# Altium project cwtrigger_usb.PrjPcb (part 1 of 2)
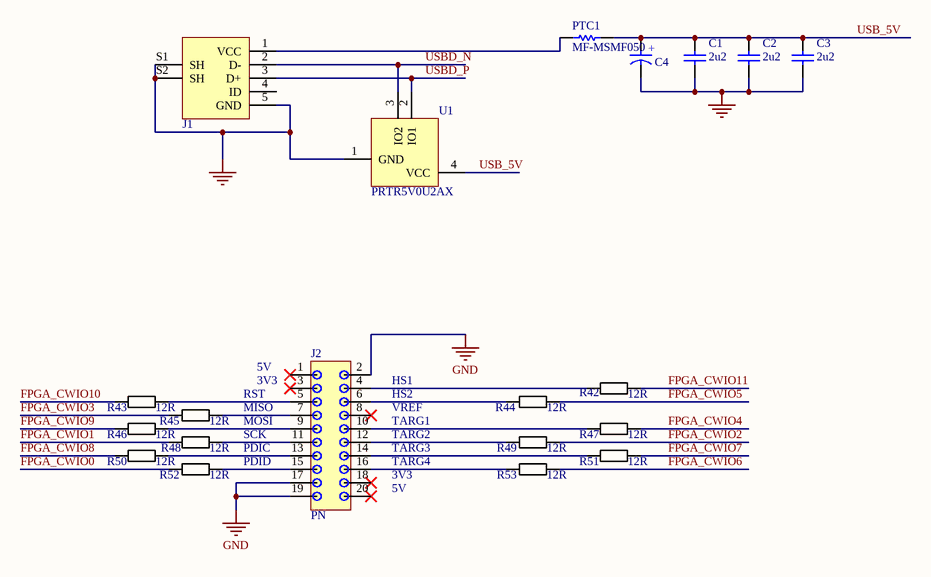
[diagram p0: ct_back.SchDoc]
PrjLicense: GPL; PrjName: PhyWhisperer-USB; PrjRev: 03
8 sheets, 163 parts. Net scope: global (net labels, ports and power ports of the same name join across sheets).
Board file: ct_mainpcb.PcbDoc
Sheets:
  ct_back.SchDoc
  ct_fpga_io.SchDoc
  ct_fpga_pwr.SchDoc
  ct_psu.SchDoc
  ct_micro.SchDoc
  fpga_misc.SchDoc
  ct_frontend.SchDoc
  ct_userio.SchDoc

## Sheet ct_back.SchDoc: Back Panel
size Letter; Organization: NewAE Technology Inc.; Address1: 1083 Queen St., Suite 196; Address2: Halifax; Address3: NS; Address4: Canada B3H 0B2; SheetNumber: 1; SheetTotal: 8; SheetApproved: YES

### Parts
C1  2u2  [CAPC0603_M]
C2  2u2  [CAPC0603_M]
C3  2u2  [CAPC0603_M]
C4  680uF  [Cap_16v_680uF]  (value not drawn)
J1  USB_MicroB_Jack  [ZX62D-B-5P8(30)]  (value not drawn)
J2  PN  [CON-20HDR-EDGEMOUNT]
PTC1  MF-MSMF050  [BOUR-MF-MSMF050-2_V]
R42  12R  [RESC1005X40N]
R43  12R  [RESC1005X40N]
R44  12R  [RESC1005X40N]
R45  12R  [RESC1005X40N]
R46  12R  [RESC1005X40N]
R47  12R  [RESC1005X40N]
R48  12R  [RESC1005X40N]
R49  12R  [RESC1005X40N]
R50  12R  [RESC1005X40N]
R51  12R  [RESC1005X40N]
R52  12R  [RESC1005X40N]
R53  12R  [RESC1005X40N]
U1  PRTR5V0U2AX  [SOT143B]

### Nets
GND: C1.2 C2.2 C3.2 C4.2 J1.5(GND) J1.S1(SH) J1.S2(SH) J2.2 J2.17 J2.19 U1.1(GND)
FPGA_CWIO0: R52.1
FPGA_CWIO1: R48.1
FPGA_CWIO2: R49.2
FPGA_CWIO3: R45.1
FPGA_CWIO4: R47.2
FPGA_CWIO5: R44.2
FPGA_CWIO6: R53.2
FPGA_CWIO7: R51.2
FPGA_CWIO8: R50.1
FPGA_CWIO9: R46.1
FPGA_CWIO10: R43.1
FPGA_CWIO11: R42.2
USB_5V: C1.1 C2.1 C3.1 C4.1 PTC1.2 U1.4(VCC)
USBD_N: J1.2(D-) U1.3(IO2)
USBD_P: J1.3(D+) U1.2(IO1)
NetJ1_1: J1.1(VCC) PTC1.1
NetJ2_4: J2.4 R42.1
NetJ2_5: J2.5 R43.2
NetJ2_6: J2.6 R44.1
NetJ2_7: J2.7 R45.2
NetJ2_9: J2.9 R46.2
NetJ2_10: J2.10 R47.1
NetJ2_11: J2.11 R48.2
NetJ2_12: J2.12 R49.1
NetJ2_13: J2.13 R50.2
NetJ2_14: J2.14 R51.1
NetJ2_15: J2.15 R52.2
NetJ2_16: J2.16 R53.1

Not connected (* = marked no-connect by the designer): J1 4(ID); J2 1* 3* 8* 18(10)* 20(10)*

### Notes on the sheet
- RST
- MISO
- MOSI
- 5V
- 3V3
- (near J2) TARG1
- (near J2) HS1
- (near J2) HS2
- (near J2) VREF
- SCK
- PDIC
- PDID
- (near J2) TARG4
- (near J2) TARG2
- (near J2) TARG3
- (near J2) 3V3
- (near J2) 5V
- Title:
- Date:
- Rev:
- Time:
- Project:
- Sheet
- of
- License:
- Copyright © NewAE Technology Inc.
- Approved:
- NewAE.com
- File:
- (in symbol Cap_16v_680uF) +

### Library data of the parts
C1-C3 = CCHIP-2u2-0603: 2u2, 0603; Manufacture 1: Samsung; Manufacture Part Number 1: CL10B225KP8NNNC; Component Group: Capacitor; Case-EIA: 0603; Case-Metric: 1608; Rated Voltage: 10VDC; Part Number: CCHIP-2u2-0603; Footprint: 0603; Pin Count: 2; Supplier 1: Digi-Key; Supplier Part Number 1: 1276-1134-2-ND; Value: 2u2; Mounting Technology: SMT; Component Kind: Standard; Component Type: Standard
C4 = Cap_16v_680uF: Aluminum electrolytic 680uF, 8x16mm, radial; Component Group: Capacitor; PP Material Stack: 0; Part Number: Cap_16v_680uF; Pin Count: 2; Value: 680uF; Mounting Technology: Through-hole; Component Kind: Standard; Component Type: Standard; PP Rotation: 0
J1 = ZX62D-B-5P8(30): CONN RCPT USB MICRO B SMD; Manufacture 1: Hirose Electric Co Ltd; Component Group: Connector; PP Material Stack: 0; Part Number: ZX62D-B-5P8(30); Manufacture Part Number 1: ZX62D-B-5P8(30); Pin Count: 5; Supplier 1: Digi-Key; Supplier Part Number 1: H125272CT-ND; Mounting Technology: Through-hole; RoHS: Yes; Component Kind: Standard; Component Type: Standard; PP Rotation: 0
J2 = CON20HDR-EDGE: Component Group: Connector; PP Material Stack: 0; Part Number: CON20HDR-EDGE; Pin Count: 20; Component Kind: Standard; Component Type: Standard; PP Rotation: 0; Supplier Part Number 1: S9172-ND; Supplier 1: Digi-Key
PTC1 = CMP-0280-00002-2: MF-MSMF Series - PTC Resettable Fuse, 15 V Max, 0.15 Ohm Min, -40 to 85 degC, RoHS, Reel; Manufacturer: Bourns; Voltage DC (Max): 15 V; Trip Current: 1 A; Hold Current: 0.5 A; Current Rating (Max): 100 A; ComponentLink1Description: Manufacturer URL; Operating Temperature Range: -40 to 85 degC; ComponentLink2URL: http://www.bourns.com/data/global/pdfs/mfmsmf.pdf; PackageReference: MF-MSMF050; ComponentLink2Description: Datasheet; PartNumber: MF-MSMF050; DatasheetVersion: Rev. AD; ComponentLink3URL: http://www.bourns.com/data/global/pdfs/mfmsmf.pdf; ComponentLink3Description: Package Specification; RoHS: TRUE; PackageDescription: 2-Pin SMD, Body 4.55 x 3.24 mm; Mounting Technology: Surface Mount; Packing: Reel; Resistance (Min): 0.15 Ohm; ComponentLink1URL: http://www.bourns.com/; Supplier 1: Digi-Key; Supplier Part Number 1: MF-MSMF050-2CT-ND
R42-R53 = RCHIP-12R-0402: 12R res, 0402, 1%, 1/16W; Manufacture 1: Yageo; Manufacture Part Number 1: RC0402FR-0712RL; Component Group: Resistor; Case-EIA: 0402; Case-Metric: 1005; Rated Power: 0.063W; Rated Voltage: 75VDC; Part Number: RCHIP-12R-0402; Footprint: 0402; Pin Count: 2; Supplier 1: Digi-Key; Supplier Part Number 1: YAG2968CT-ND; Value: 12R; Tolerance: 1%; Mounting Technology: SMT; Temperature Range: -55C to 155C; Component Kind: Standard; Component Type: Standard
U1 = PRTR5V0U2AX: USB 2.0 high-speed ESD; Component Group: Diode; Supplier 1: Digi-Key; Supplier Part Number 1: 568-7445-1-ND; Part Number: PRTR5V0U2AX; Pin Count: 4; Component Kind: Standard; Component Type: Standard

## Sheet ct_fpga_io.SchDoc: FPGA I/O
size Letter; Organization: NewAE Technology Inc.; Address1: 1083 Queen St., Suite 196; Address2: Halifax; Address3: NS; Address4: Canada B3H 0B2; SheetNumber: 2; SheetTotal: 8; SheetApproved: YES
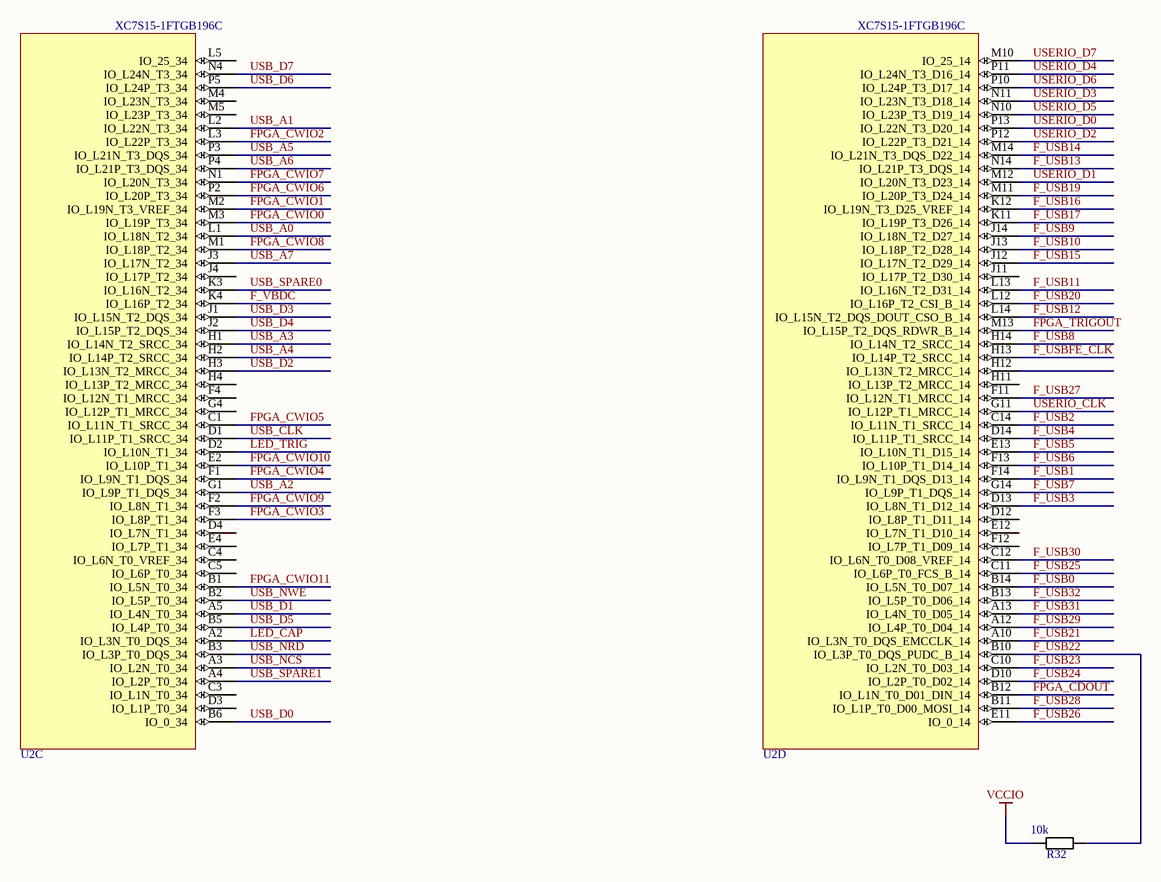
[diagram p1: ct_fpga_io.SchDoc]

### Parts
R32  10k  [RESC1608X55N]
U2  XC7S15-1FTGB196C  [BGA_FTGB196]  (parts C,D of 4)

### Nets
VCCIO: R32.1
F_USB0: U2.B14(IO_L5N_T0_D07_14)
F_USB1: U2.F14(IO_L9N_T1_DQS_D13_14)
F_USB2: U2.C14(IO_L11N_T1_SRCC_14)
F_USB3: U2.D13(IO_L8N_T1_D12_14)
F_USB4: U2.D14(IO_L11P_T1_SRCC_14)
F_USB5: U2.E13(IO_L10N_T1_D15_14)
F_USB6: U2.F13(IO_L10P_T1_D14_14)
F_USB7: U2.G14(IO_L9P_T1_DQS_14)
F_USB8: U2.H14(IO_L14N_T2_SRCC_14)
F_USB9: U2.J14(IO_L18N_T2_D27_14)
F_USB10: U2.J13(IO_L18P_T2_D28_14)
F_USB11: U2.L13(IO_L16N_T2_D31_14)
F_USB12: U2.L14(IO_L15N_T2_DQS_DOUT_CSO_B_14)
F_USB13: U2.N14(IO_L21P_T3_DQS_14)
F_USB14: U2.M14(IO_L21N_T3_DQS_D22_14)
F_USB15: U2.J12(IO_L17N_T2_D29_14)
F_USB16: U2.K12(IO_L19N_T3_D25_VREF_14)
F_USB17: U2.K11(IO_L19P_T3_D26_14)
F_USB19: U2.M11(IO_L20P_T3_D24_14)
F_USB20: U2.L12(IO_L16P_T2_CSI_B_14)
F_USB21: U2.A10(IO_L3N_T0_DQS_EMCCLK_14)
F_USB22: R32.2 U2.B10(IO_L3P_T0_DQS_PUDC_B_14)
F_USB23: U2.C10(IO_L2N_T0_D03_14)
F_USB24: U2.D10(IO_L2P_T0_D02_14)
F_USB25: U2.C11(IO_L6P_T0_FCS_B_14)
F_USB26: U2.E11(IO_0_14)
F_USB27: U2.F11(IO_L12N_T1_MRCC_14)
F_USB28: U2.B11(IO_L1P_T0_D00_MOSI_14)
F_USB29: U2.A12(IO_L4P_T0_D04_14)
F_USB30: U2.C12(IO_L6N_T0_D08_VREF_14)
F_USB31: U2.A13(IO_L4N_T0_D05_14)
F_USB32: U2.B13(IO_L5P_T0_D06_14)
F_USBFE_CLK: U2.H13(IO_L14P_T2_SRCC_14)
F_VBDC: U2.K4(IO_L16P_T2_34)
FPGA_CDOUT: U2.B12(IO_L1N_T0_D01_DIN_14)
FPGA_CWIO0: U2.M3(IO_L19P_T3_34)
FPGA_CWIO1: U2.M2(IO_L19N_T3_VREF_34)
FPGA_CWIO2: U2.L3(IO_L22P_T3_34)
FPGA_CWIO3: U2.F3(IO_L8P_T1_34)
FPGA_CWIO4: U2.F1(IO_L9N_T1_DQS_34)
FPGA_CWIO5: U2.C1(IO_L11N_T1_SRCC_34)
FPGA_CWIO6: U2.P2(IO_L20P_T3_34)
FPGA_CWIO7: U2.N1(IO_L20N_T3_34)
FPGA_CWIO8: U2.M1(IO_L18P_T2_34)
FPGA_CWIO9: U2.F2(IO_L8N_T1_34)
FPGA_CWIO10: U2.E2(IO_L10P_T1_34)
FPGA_CWIO11: U2.B1(IO_L5N_T0_34)
FPGA_TRIGOUT: U2.M13(IO_L15P_T2_DQS_RDWR_B_14)
LED_CAP: U2.A2(IO_L3N_T0_DQS_34)
LED_TRIG: U2.D2(IO_L10N_T1_34)
USB_A0: U2.L1(IO_L18N_T2_34)
USB_A1: U2.L2(IO_L22N_T3_34)
USB_A2: U2.G1(IO_L9P_T1_DQS_34)
USB_A3: U2.H1(IO_L14N_T2_SRCC_34)
USB_A4: U2.H2(IO_L14P_T2_SRCC_34)
USB_A5: U2.P3(IO_L21N_T3_DQS_34)
USB_A6: U2.P4(IO_L21P_T3_DQS_34)
USB_A7: U2.J3(IO_L17N_T2_34)
USB_CLK: U2.D1(IO_L11P_T1_SRCC_34)
USB_D0: U2.B6(IO_0_34)
USB_D1: U2.A5(IO_L4N_T0_34)
USB_D2: U2.H3(IO_L13N_T2_MRCC_34)
USB_D3: U2.J1(IO_L15N_T2_DQS_34)
USB_D4: U2.J2(IO_L15P_T2_DQS_34)
USB_D5: U2.B5(IO_L4P_T0_34)
USB_D6: U2.P5(IO_L24P_T3_34)
USB_D7: U2.N4(IO_L24N_T3_34)
USB_NCS: U2.A3(IO_L2N_T0_34)
USB_NRD: U2.B3(IO_L3P_T0_DQS_34)
USB_NWE: U2.B2(IO_L5P_T0_34)
USB_SPARE0: U2.K3(IO_L16N_T2_34)
USB_SPARE1: U2.A4(IO_L2P_T0_34)
USERIO_CLK: U2.G11(IO_L12P_T1_MRCC_14)
USERIO_D0: U2.P13(IO_L22N_T3_D20_14)
USERIO_D1: U2.M12(IO_L20N_T3_D23_14)
USERIO_D2: U2.P12(IO_L22P_T3_D21_14)
USERIO_D3: U2.N11(IO_L23N_T3_D18_14)
USERIO_D4: U2.P11(IO_L24N_T3_D16_14)
USERIO_D5: U2.N10(IO_L23P_T3_D19_14)
USERIO_D6: U2.P10(IO_L24P_T3_D17_14)
USERIO_D7: U2.M10(IO_25_14)

Not connected (* = marked no-connect by the designer): U2 C3(IO_L1N_T0_34) C4(IO_L6N_T0_VREF_34) C5(IO_L6P_T0_34) D3(IO_L1P_T0_34) D4(IO_L7N_T1_34) D12(IO_L8P_T1_D11_14) E4(IO_L7P_T1_34) E12(IO_L7N_T1_D10_14) F4(IO_L12N_T1_MRCC_34) F12(IO_L7P_T1_D09_14) G4(IO_L12P_T1_MRCC_34) H4(IO_L13P_T2_MRCC_34) H11(IO_L13P_T2_MRCC_14) H12(IO_L13N_T2_MRCC_14) J4(IO_L17P_T2_34) J11(IO_L17P_T2_D30_14) L5(IO_25_34) M4(IO_L23N_T3_34) M5(IO_L23P_T3_34)

### Notes on the sheet
- Title:
- Date:
- Rev:
- Time:
- Project:
- Sheet
- of
- License:
- Copyright © NewAE Technology Inc.
- Approved:
- NewAE.com
- File:

### Library data of the parts
R32 = RCHIP-10K-0603: 10k res, 0603, 1%, 1/10W; Manufacture 1: Yageo; Manufacture Part Number 1: RC0603FR-0710KL; Component Group: Resistor; Case-EIA: 0603; Case-Metric: 1608; Rated Power: 0.1W; Rated Voltage: 75VDC; Part Number: RCHIP-10K-0603; Footprint: 0603; Pin Count: 2; Supplier 1: Digi-Key; Supplier Part Number 1: 311-10.0KHRCT-ND; Value: 10k; Tolerance: 1%; Mounting Technology: SMT; Temperature Range: -55C to 155C; Component Kind: Standard; Component Type: Standard
U2 = XC7S15-1FTGB196C: Xilinx Spartan 7 FPGA, 196FTGB; Component Group: Digital IC; PP Material Stack: 0; Part Number: XC7S15-1FTGB196C; Manufacture 1: Xilinx; Manufacture Part Number 1: XC7S15-1FTGB196C; Pin Count: 196; Supplier 1: Digi-Key; Supplier Part Number 1: 122-2226-ND; Mounting Technology: SMT; Component Kind: Standard; Component Type: Standard; PP Rotation: 0

## Sheet ct_fpga_pwr.SchDoc: FPGA Power Connections
size Letter; SheetNumber: 3; SheetTotal: 8; SheetApproved: YES
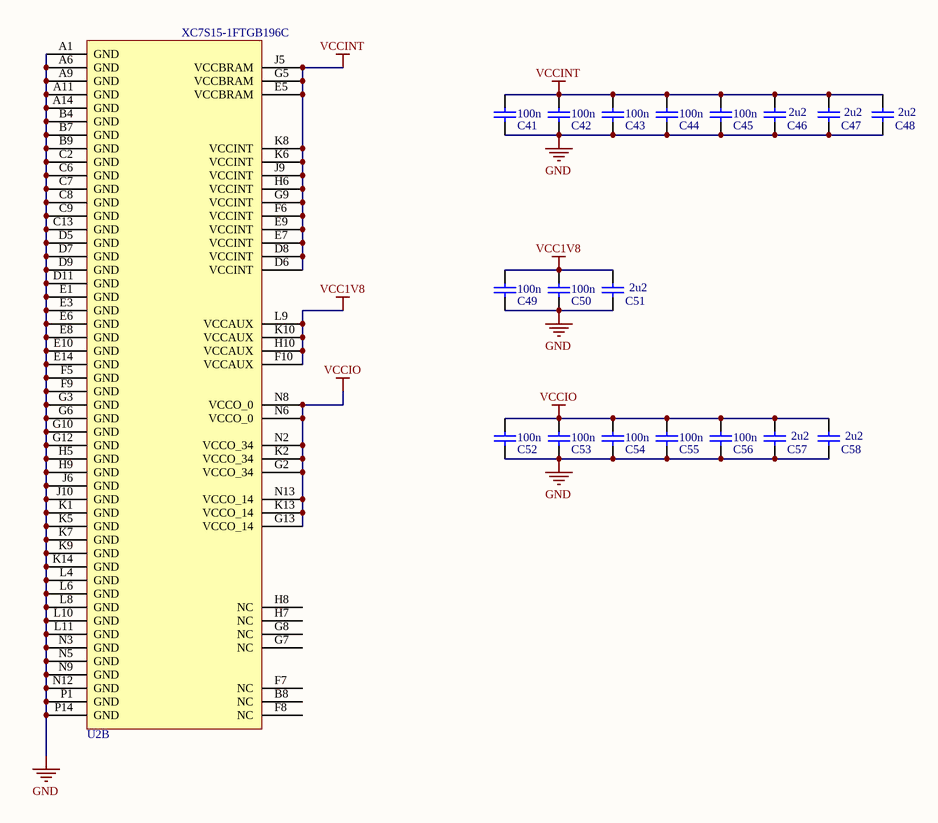
[diagram p2: ct_fpga_pwr.SchDoc]

### Parts
C41  100n  [CAPC0402_M]
C42  100n  [CAPC0402_M]
C43  100n  [CAPC0402_M]
C44  100n  [CAPC0402_M]
C45  100n  [CAPC0402_M]
C46  2u2  [CAPC0603_M]
C47  2u2  [CAPC0603_M]
C48  2u2  [CAPC0603_M]
C49  100n  [CAPC0402_M]
C50  100n  [CAPC0402_M]
C51  2u2  [CAPC0603_M]
C52  100n  [CAPC0402_M]
C53  100n  [CAPC0402_M]
C54  100n  [CAPC0402_M]
C55  100n  [CAPC0402_M]
C56  100n  [CAPC0402_M]
C57  2u2  [CAPC0603_M]
C58  2u2  [CAPC0603_M]
U2  XC7S15-1FTGB196C  [BGA_FTGB196]  (part B of 4)

### Nets
GND: C41.2 C42.2 C43.2 C44.2 C45.2 C46.2 C47.2 C48.2 C49.2 C50.2 C51.2 C52.2 C53.2 C54.2 C55.2 C56.2 C57.2 C58.2 U2.A1(GND) U2.A6(GND) U2.A9(GND) U2.A11(GND) U2.A14(GND) U2.B4(GND) U2.B7(GND) U2.B9(GND) U2.C2(GND) U2.C6(GND) U2.C7(GND) U2.C8(GND) U2.C9(GND) U2.C13(GND) U2.D5(GND) U2.D7(GND) U2.D9(GND) U2.D11(GND) U2.E1(GND) U2.E3(GND) U2.E6(GND) U2.E8(GND) U2.E10(GND) U2.E14(GND) U2.F5(GND) U2.F9(GND) U2.G3(GND) U2.G6(GND) U2.G10(GND) U2.G12(GND) U2.H5(GND) U2.H9(GND) U2.J6(GND) U2.J10(GND) U2.K1(GND) U2.K5(GND) U2.K7(GND) U2.K9(GND) U2.K14(GND) U2.L4(GND) U2.L6(GND) U2.L8(GND) U2.L10(GND) U2.L11(GND) U2.N3(GND) U2.N5(GND) U2.N9(GND) U2.N12(GND) U2.P1(GND) U2.P14(GND)
VCC1V8: C49.1 C50.1 C51.1 U2.F10(VCCAUX) U2.H10(VCCAUX) U2.K10(VCCAUX) U2.L9(VCCAUX)
VCCINT: C41.1 C42.1 C43.1 C44.1 C45.1 C46.1 C47.1 C48.1 U2.D6(VCCINT) U2.D8(VCCINT) U2.E5(VCCBRAM) U2.E7(VCCINT) U2.E9(VCCINT) U2.F6(VCCINT) U2.G5(VCCBRAM) U2.G9(VCCINT) U2.H6(VCCINT) U2.J5(VCCBRAM) U2.J9(VCCINT) U2.K6(VCCINT) U2.K8(VCCINT)
VCCIO: C52.1 C53.1 C54.1 C55.1 C56.1 C57.1 C58.1 U2.G2(VCCO_34) U2.G13(VCCO_14) U2.K2(VCCO_34) U2.K13(VCCO_14) U2.N2(VCCO_34) U2.N6(VCCO_0) U2.N8(VCCO_0) U2.N13(VCCO_14)

Not connected (* = marked no-connect by the designer): U2 B8(NC) F7(NC) F8(NC) G7(NC) G8(NC) H7(NC) H8(NC)

### Notes on the sheet
- Title:
- Date:
- Rev:
- Time:
- Project:
- Sheet
- of
- License:
- Copyright © NewAE Technology Inc.
- Approved:
- NewAE.com
- File:

### Library data of the parts
C41-C45 C49 C50 C52-C56 = CCHIP-100n-0402: 100n, 0402; Component Group: Capacitor; Case-EIA: 0402; Part Number: CCHIP-100n-0402; Footprint: 0402; Pin Count: 2; Value: 100n; Mounting Technology: SMT; Component Kind: Standard; Component Type: Standard
C46-C48 C51 C57 C58 = CCHIP-2u2-0603: as C1 on sheet ct_back; Part Number: CCHIP-2u2-0603; Footprint: 0603; Pin Count: 2; Supplier 1: Digi-Key; Supplier Part Number 1: 1276-1134-2-ND; Value: 2u2; Mounting Technology: SMT; Component Kind: Standard; Component Type: Standard
U2 = XC7S15-1FTGB196C: as U2 on sheet ct_fpga_io; Part Number: XC7S15-1FTGB196C; Manufacture 1: Xilinx; Manufacture Part Number 1: XC7S15-1FTGB196C; Pin Count: 196; Supplier 1: Digi-Key; Supplier Part Number 1: 122-2226-ND; Mounting Technology: SMT; Component Kind: Standard; Component Type: Standard; PP Rotation: 0

## Sheet ct_psu.SchDoc: Power Supply
size Letter; Organization: NewAE Technology Inc.; Address1: 1083 Queen St., Suite 196; Address2: Halifax; Address3: NS; Address4: Canada B3H 0B2; SheetNumber: 4; SheetTotal: 8; SheetApproved: YES
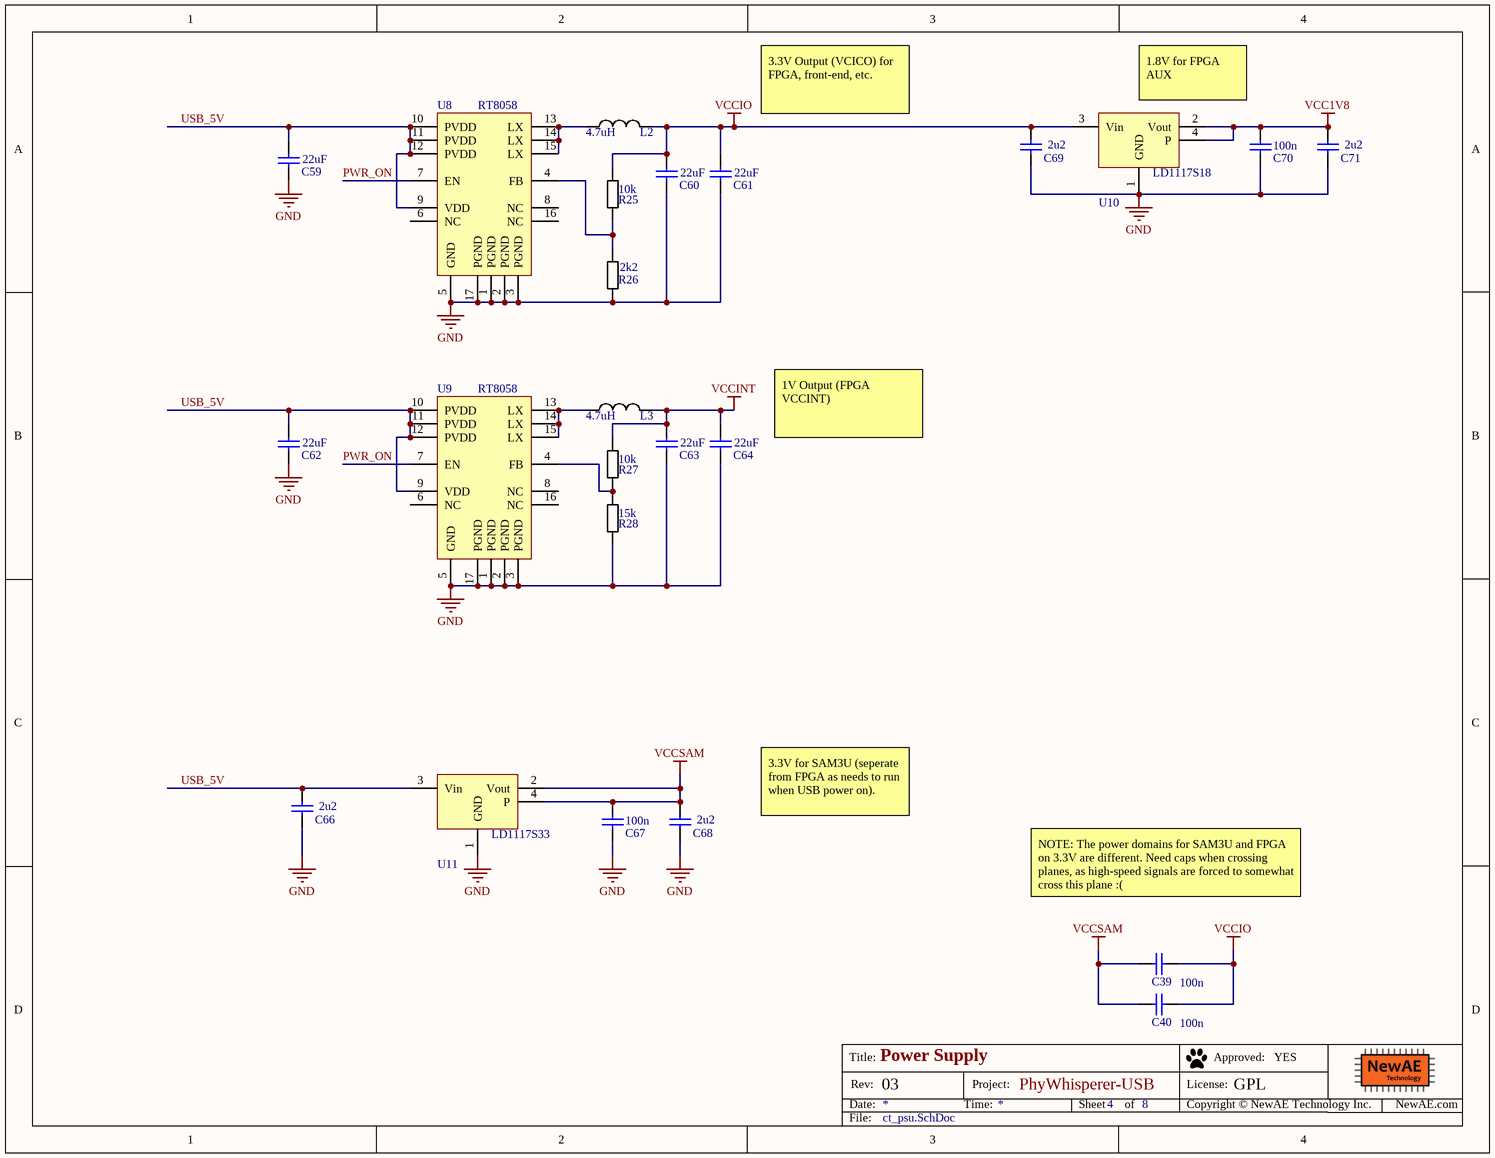
[diagram p3: ct_psu.SchDoc]

### Parts
C39  100n  [CAPC0603_M]
C40  100n  [CAPC0603_M]
C59  22uF  [CAPC0805_M]
C60  22uF  [CAPC0805_M]
C61  22uF  [CAPC0805_M]
C62  22uF  [CAPC0805_M]
C63  22uF  [CAPC0805_M]
C64  22uF  [CAPC0805_M]
C66  2u2  [CAPC0603_M]
C67  100n  [CAPC0402_M]
C68  2u2  [CAPC0603_M]
C69  2u2  [CAPC0603_M]
C70  100n  [CAPC0402_M]
C71  2u2  [CAPC0603_M]
L2  4.7uH  [NR6028]
L3  4.7uH  [NR6028]
R25  10k  [RESC1608X55N]
R26  2k2  [RESC1608X55N]
R27  10k  [RESC1608X55N]
R28  15k  [RESC1608X55N]
U8  RT8058  [QFN16_50P300X300X100_HS-17M]
U9  RT8058  [QFN16_50P300X300X100_HS-17M]
U10  LD1117S18  [SOT-223]
U11  LD1117S33  [SOT-223]

### Nets
GND: C59.2 C60.2 C61.2 C62.2 C63.2 C64.2 C66.2 C67.2 C68.2 C69.2 C70.2 C71.2 R26.2 R28.2 U8.1(PGND) U8.2(PGND) U8.3(PGND) U8.5(GND) U8.17(PGND) U9.1(PGND) U9.2(PGND) U9.3(PGND) U9.5(GND) U9.17(PGND) U10.1(GND) U11.1(GND)
VCC1V8: C70.1 C71.1 U10.2(Vout) U10.4(P)
VCCINT: C63.1 C64.1 L3.2 R27.1
VCCIO: C39.2 C40.2 C60.1 C61.1 C69.1 L2.2 R25.1 U10.3(Vin)
VCCSAM: C39.1 C40.1 C67.1 C68.1 U11.2(Vout) U11.4(P)
PWR_ON: U8.7(EN) U9.7(EN)
USB_5V: C59.1 C62.1 C66.1 U8.9(VDD) U8.10(PVDD) U8.11(PVDD) U8.12(PVDD) U9.9(VDD) U9.10(PVDD) U9.11(PVDD) U9.12(PVDD) U11.3(Vin)
NetL2_1: L2.1 U8.13(LX) U8.14(LX) U8.15(LX)
NetL3_1: L3.1 U9.13(LX) U9.14(LX) U9.15(LX)
NetR25_2: R25.2 R26.1 U8.4(FB)
NetR27_2: R27.2 R28.1 U9.4(FB)

Not connected (* = marked no-connect by the designer): U8 6(NC) 8(NC) 16(NC); U9 6(NC) 8(NC) 16(NC)

### Notes on the sheet
- 1.8V for FPGA AUX
- 3.3V Output (VCICO) for FPGA, front-end, etc.
- 1V Output (FPGA VCCINT)
- 3.3V for SAM3U (seperate from FPGA as needs to run when USB power on).
- NOTE: The power domains for SAM3U and FPGA on 3.3V are different. Need caps when crossing planes, as high-speed signals are forced to somewhat cross this plane :(
- Title:
- Date:
- Rev:
- Time:
- Project:
- Sheet
- of
- License:
- Copyright © NewAE Technology Inc.
- Approved:
- NewAE.com
- File:

### Library data of the parts
C39 C40 = CCHIP-100n-0603: 100n, 0603; Manufacture 1: Kemet; Manufacture Part Number 1: C0603C104K5RACTU; Component Group: Capacitor; Case-EIA: 0603; Case-Metric: 1608; Rated Voltage: 50VDC; Part Number: CCHIP-100n-0603; Footprint: 0603; Pin Count: 2; Supplier 1: Digi-Key; Supplier Part Number 1: 399-5089-2-ND; Value: 100n; Mounting Technology: SMT; Component Kind: Standard; Component Type: Standard
C59-C64 = CCHIP-22u-0805-16V: 22u, 16V, 0805, Ceramic; Manufacture 1: Samsung Electro-Mechanics; Manufacture Part Number 1: CL21A226MOCLRNC; Component Group: Capacitor; Case-EIA: 0805; Case-Metric: 1608; Rated Voltage: 16VDC; Tolerance: 20%; Part Number: CCHIP-22u-0805-16V; Footprint: 0805; Pin Count: 2; Supplier 1: Digi-Key; Supplier Part Number 1: 1276-6780-1-ND; Value: 22uF; Mounting Technology: SMT; RoHS: Yes; Component Kind: Standard; Component Type: Standard
C66 C68 C69 C71 = CCHIP-2u2-0603: as C1 on sheet ct_back; Part Number: CCHIP-2u2-0603; Footprint: 0603; Pin Count: 2; Supplier 1: Digi-Key; Supplier Part Number 1: 1276-1134-2-ND; Value: 2u2; Mounting Technology: SMT; Component Kind: Standard; Component Type: Standard
C67 C70 = CCHIP-100n-0402: as C41 on sheet ct_fpga_pwr; Part Number: CCHIP-100n-0402; Footprint: 0402; Pin Count: 2; Value: 100n; Mounting Technology: SMT; Component Kind: Standard; Component Type: Standard
L2 L3 = NR6028T4R7M: fixed ind, ferrite, shielded; Manufacture 1: Taiyo Yuden; Component Group: Inductor; Case-Metric: 6060; Part Number: NR6028T4R7M; Footprint: SMD,6x6mm; Manufacture Part Number 1: NR6028T4R7M; Pin Count: 2; Supplier 1: Digi-Key; Supplier Part Number 1: 587-2100-1-ND; Value: 4.7uH; Mounting Technology: SMT; Component Kind: Standard; Component Type: Standard
R25 R27 = RCHIP-10K-0603: as R32 on sheet ct_fpga_io; Part Number: RCHIP-10K-0603; Footprint: 0603; Pin Count: 2; Supplier 1: Digi-Key; Supplier Part Number 1: 311-10.0KHRCT-ND; Value: 10k; Tolerance: 1%; Mounting Technology: SMT; Temperature Range: -55C to 155C; Component Kind: Standard; Component Type: Standard
R26 = RCHIP-2K2-0603: 2k2 res, 0603, 1%, 1/10W; Manufacture 1: Yageo; Manufacture Part Number 1: RC0603FR-072K2L; Component Group: Resistor; Case-EIA: 0603; Case-Metric: 1608; Rated Power: 0.1W; Rated Voltage: 75VDC; Part Number: RCHIP-2K2-0603; Footprint: 0603; Pin Count: 2; Supplier 1: Digi-Key; Supplier Part Number 1: 311-2.20KHRCT-ND; Value: 2k2; Tolerance: 1%; Mounting Technology: SMT; Temperature Range: -55C to 155C; Component Kind: Standard; Component Type: Standard
R28 = RCHIP-15K-0603: 15k res, 0603, 1%, 1/10W; Manufacture 1: Yageo; Manufacture Part Number 1: RC0603FR-0715KL; Component Group: Resistor; Case-EIA: 0603; Case-Metric: 1608; Rated Power: 0.1W; Rated Voltage: 75VDC; Part Number: RCHIP-15K-0603; Footprint: 0603; Pin Count: 2; Supplier 1: Digi-Key; Supplier Part Number 1: 311-15.0KHRCT-ND; Value: 15k; Tolerance: 1%; Mounting Technology: SMT; Temperature Range: -55C to 155C; Component Kind: Standard; Component Type: Standard
U8 U9 = RT8058: Switching supply controller, 2A; Manufacture 1: Richtek; Component Group: Analog IC; PP Material Stack: 0; Part Number: RT8058; Footprint: QFN16; Manufacture Part Number 1: RT8058; Pin Count: 17; Component Kind: Standard; Component Type: Standard; PP Rotation: 0
U10 = LD1117S18: IC REG LIN POS 1.8V 800MA SOT223; Manufacture 1: STMicroelectronics; Manufacture Part Number 1: LD1117S18TR; Component Group: Analog IC; Rated Voltage: 15V; PP Material Stack: 0; Part Number: LD1117S18; Pin Count: 3; Supplier 1: Digi-Key; Supplier Part Number 1: 497-7308-1-ND; Mounting Technology: SMT; RoHS: Yes; Component Kind: Standard; Component Type: Standard; PP Rotation: 0
U11 = LD1117S33: IC REG LIN POS 3.3V 800MA SOT223; Manufacture 1: STMicroelectronics; Manufacture Part Number 1: LD1117S33TR; Component Group: Analog IC; Rated Voltage: 15V; PP Material Stack: 0; Part Number: LD1117S33; Pin Count: 3; Supplier 1: Digi-Key; Supplier Part Number 1: 497-1242-1-ND; Mounting Technology: SMT; RoHS: Yes; Component Kind: Standard; Component Type: Standard; PP Rotation: 0

## Sheet ct_micro.SchDoc: Microcontroller
size Letter; Organization: NewAE Technology Inc.; Address1: 1083 Queen St., Suite 196; Address2: Halifax; Address3: NS; Address4: Canada B3H 0B2; SheetNumber: 5; SheetTotal: 8; SheetApproved: YES
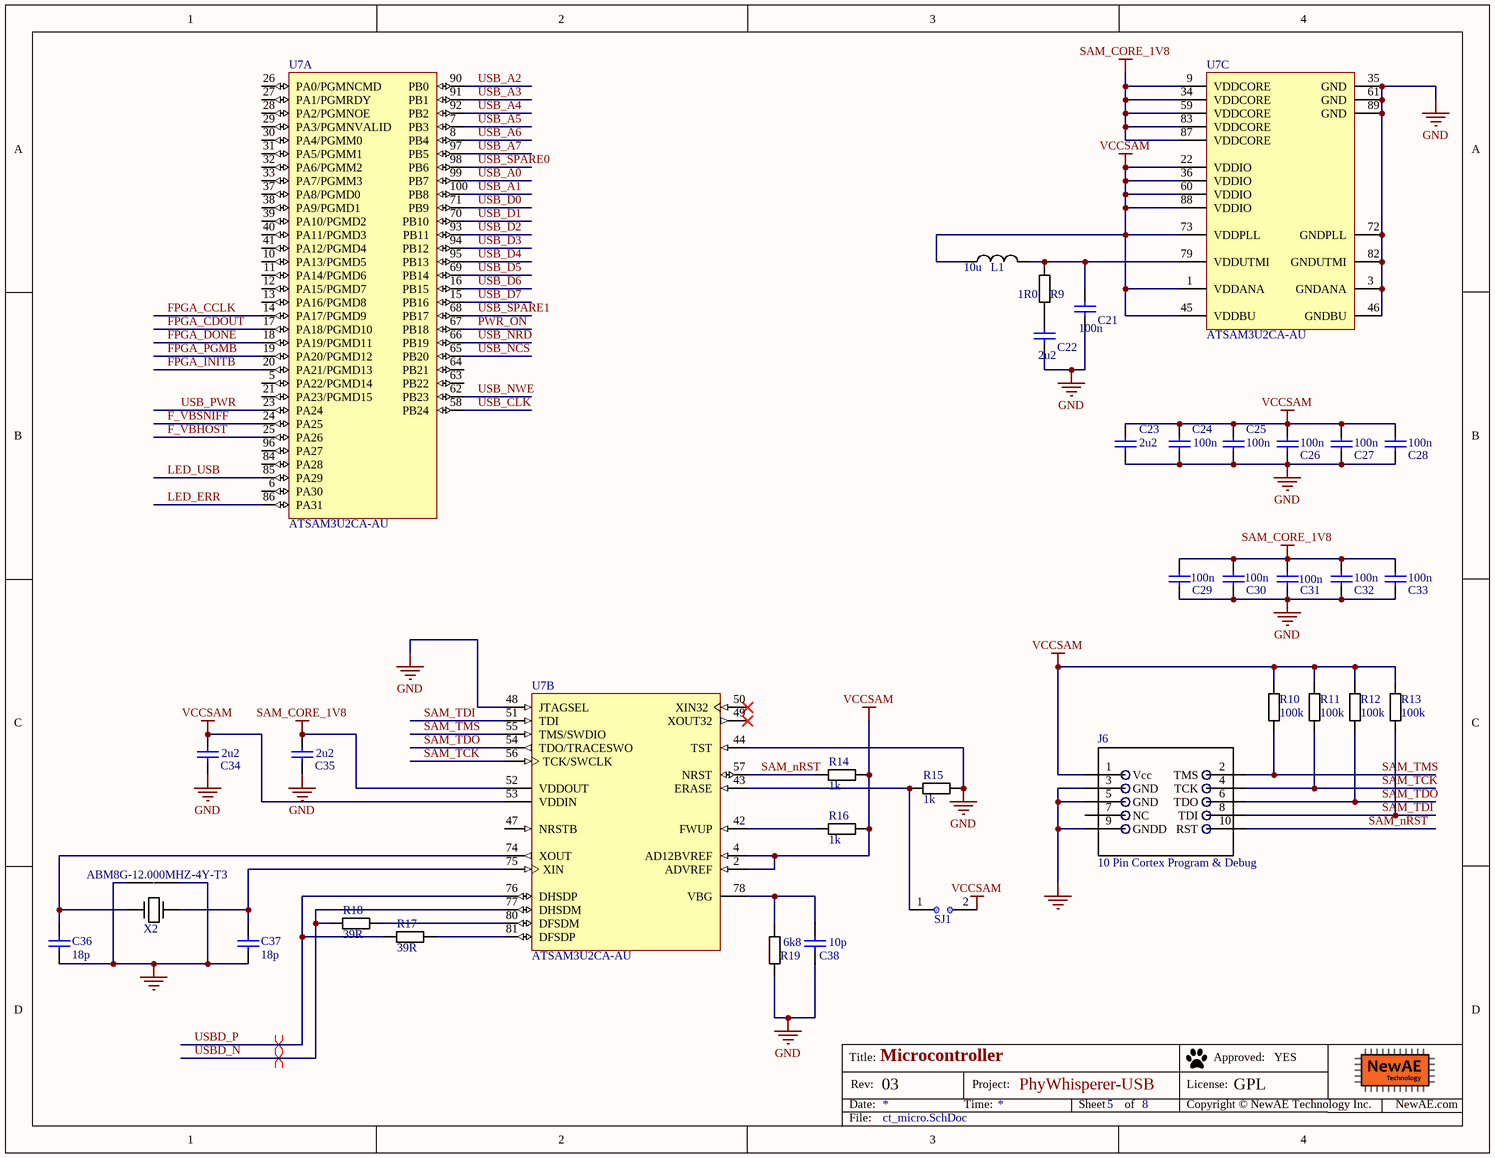
[diagram p4: ct_micro.SchDoc]

### Parts
C21  100n  [CAPC0402_M]
C22  2u2  [CAPC0603_M]
C23  2u2  [CAPC0603_M]
C24  100n  [CAPC0402_M]
C25  100n  [CAPC0402_M]
C26  100n  [CAPC0402_M]
C27  100n  [CAPC0402_M]
C28  100n  [CAPC0402_M]
C29  100n  [CAPC0402_M]
C30  100n  [CAPC0402_M]
C31  100n  [CAPC0402_M]
C32  100n  [CAPC0402_M]
C33  100n  [CAPC0402_M]
C34  2u2  [CAPC0603_M]
C35  2u2  [CAPC0603_M]
C36  18p  [CAPC0402_M]
C37  18p  [CAPC0402_M]
C38  10p  [CAPC0603_M]
J6  10 Pin Cortex Program & Debug  [0.5mm_SMD_Header_5x2]
L1  10u  [IND_0603]
R9  1R0  [RESC1608X55N]
R10  100k  [RESC1608X55N]
R11  100k  [RESC1608X55N]
R12  100k  [RESC1608X55N]
R13  100k  [RESC1608X55N]
R14  1k  [RESC1608X55N]
R15  1k  [RESC1608X55N]
R16  1k  [RESC1608X55N]
R17  39R  [RESC1608X55N]
R18  39R  [RESC1608X55N]
R19  6k8  [RESC1608X55N]
SJ1  NO  [SJ_2S_NO]  (value not drawn)  (no BOM)
U7  ATSAM3U2CA-AU  [LQFP100_L]  (parts A,B,C of 3)
X2  ABM8G-12.000MHZ-4Y-T3  [ABM8G]

### Nets
GND: C21.2 C22.2 C23.2 C24.2 C25.2 C26.2 C27.2 C28.2 C29.2 C30.2 C31.2 C32.2 C33.2 C34.2 C35.2 C36.2 C37.2 C38.2 J6.3(GND) J6.5(GND) J6.9(GNDD) R15.2 R19.2 U7.3(GNDANA) U7.35(GND) U7.44(TST) U7.46(GNDBU) U7.48(JTAGSEL) U7.61(GND) U7.72(GNDPLL) U7.82(GNDUTMI) U7.89(GND) X2.2(GND) X2.4(GND)
SAM_CORE_1V8: C29.1 C30.1 C31.1 C32.1 C33.1 C35.1 U7.9(VDDCORE) U7.34(VDDCORE) U7.52(VDDOUT) U7.59(VDDCORE) U7.83(VDDCORE) U7.87(VDDCORE)
VCCSAM: C23.1 C24.1 C25.1 C26.1 C27.1 C28.1 C34.1 J6.1(Vcc) L1.1 R10.1 R11.1 R12.1 R13.1 R14.2 R16.2 SJ1.2 U7.1(VDDANA) U7.2(ADVREF) U7.4(AD12BVREF) U7.22(VDDIO) U7.36(VDDIO) U7.45(VDDBU) U7.53(VDDIN) U7.60(VDDIO) U7.73(VDDPLL) U7.88(VDDIO)
F_VBHOST: U7.25(PA26)
F_VBSNIFF: U7.24(PA25)
FPGA_CCLK: U7.14(PA17/PGMD9)
FPGA_CDOUT: U7.17(PA18/PGMD10)
FPGA_DONE: U7.18(PA19/PGMD11)
FPGA_INITB: U7.20(PA21/PGMD13)
FPGA_PGMB: U7.19(PA20/PGMD12)
LED_ERR: U7.86(PA31)
LED_USB: U7.85(PA29)
PWR_ON: U7.67(PB18)
SAM_nRST: J6.10(RST) R14.1 U7.57(NRST)
SAM_TCK: J6.4(TCK) R11.2 U7.56(TCK/SWCLK)
SAM_TDI: J6.8(TDI) R13.2 U7.51(TDI)
SAM_TDO: J6.6(TDO) R12.2 U7.54(TDO/TRACESWO)
SAM_TMS: J6.2(TMS) R10.2 U7.55(TMS/SWDIO)
USB_A0: U7.99(PB7)
USB_A1: U7.100(PB8)
USB_A2: U7.90(PB0)
USB_A3: U7.91(PB1)
USB_A4: U7.92(PB2)
USB_A5: U7.7(PB3)
USB_A6: U7.8(PB4)
USB_A7: U7.97(PB5)
USB_CLK: U7.58(PB24)
USB_D0: U7.71(PB9)
USB_D1: U7.70(PB10)
USB_D2: U7.93(PB11)
USB_D3: U7.94(PB12)
USB_D4: U7.95(PB13)
USB_D5: U7.69(PB14)
USB_D6: U7.16(PB15)
USB_D7: U7.15(PB16)
USB_NCS: U7.65(PB20)
USB_NRD: U7.66(PB19)
USB_NWE: U7.62(PB23)
USB_PWR: U7.23(PA24)
USB_SPARE0: U7.98(PB6)
USB_SPARE1: U7.68(PB17)
USBD_N: R18.1 U7.77(DHSDM)
USBD_P: R17.1 U7.76(DHSDP)
NetC21_1: C21.1 L1.2 R9.1 U7.79(VDDUTMI)
NetC22_1: C22.1 R9.2
NetC36_1: C36.1 U7.74(XOUT) X2.1(IN)
NetC37_1: C37.1 U7.75(XIN) X2.3(OUT)
NetC38_1: C38.1 R19.1 U7.78(VBG)
NetR15_1: R15.1 SJ1.1 U7.43(ERASE)
NetR16_1: R16.1 U7.42(FWUP)
NetR17_2: R17.2 U7.81(DFSDP)
NetR18_2: R18.2 U7.80(DFSDM)

Not connected (* = marked no-connect by the designer): J6 7(NC); U7 5(PA22/PGMD14) 6(PA30) 10(PA13/PGMD5) 11(PA14/PGMD6) 12(PA15/PGMD7) 13(PA16/PGMD8) 21(PA23/PGMD15) 26(PA0/PGMNCMD) 27(PA1/PGMRDY) 28(PA2/PGMNOE) 29(PA3/PGMNVALID) 30(PA4/PGMM0) 31(PA5/PGMM1) 32(PA6/PGMM2) 33(PA7/PGMM3) 37(PA8/PGMD0) 38(PA9/PGMD1) 39(PA10/PGMD2) 40(PA11/PGMD3) 41(PA12/PGMD4) 47(NRSTB) 49(XOUT32)* 50(XIN32)* 63(PB22) 64(PB21) 84(PA28) 96(PA27)

### Layout directives
differential pair: USBD_N, USBD_P

### Notes on the sheet
- Title:
- Date:
- Rev:
- Time:
- Project:
- Sheet
- of
- License:
- Copyright © NewAE Technology Inc.
- Approved:
- NewAE.com
- File:

### Library data of the parts
C21 C24-C33 = CCHIP-100n-0402: as C41 on sheet ct_fpga_pwr; Part Number: CCHIP-100n-0402; Footprint: 0402; Pin Count: 2; Value: 100n; Mounting Technology: SMT; Component Kind: Standard; Component Type: Standard
C22 C23 C34 C35 = CCHIP-2u2-0603: as C1 on sheet ct_back; Part Number: CCHIP-2u2-0603; Footprint: 0603; Pin Count: 2; Supplier 1: Digi-Key; Supplier Part Number 1: 1276-1134-2-ND; Value: 2u2; Mounting Technology: SMT; Component Kind: Standard; Component Type: Standard
C36 C37 = CCHIP-18p-0402: 18p, 0402; Manufacture Part Number 1: GRM1555C1H180JA01D; Component Group: Capacitor; Case-EIA: 0402; Part Number: CCHIP-18p-0402; Footprint: 0402; Pin Count: 2; Value: 18p; Mounting Technology: SMT; Component Kind: Standard; Component Type: Standard
C38 = CCHIP-10p-0603: 10p, 0603; Component Group: Capacitor; Case-EIA: 0603; Case-Metric: 1608; Part Number: CCHIP-10p-0603; Footprint: 0603; Pin Count: 2; Supplier 1: Digi-Key; Supplier Part Number 1: 399-1049-1-ND; Value: 10p; Mounting Technology: SMT; Component Kind: Standard; Component Type: Standard
J6 = Cortex_Debug_Header_10Pin: 10 Pin Cortex Program & Debug 0.5mm pitch; Manufacture Part Number 1: 20021121-00010C4LF; Component Group: Connector; PP Material Stack: 0; Part Number: Cortex_Debug_Header_10Pin; Pin Count: 10; Supplier 1: Digi-Key; Supplier Part Number 1: 609-3695-1-ND; Mounting Technology: SMT; RoHS: Yes; Component Kind: Standard; Component Type: Standard; PP Rotation: 0
L1 = LCHIP-10U-0603: FIXED IND 10UH 50MA 900 MOHM SMD; Manufacture 1: Murata Electronics North America; Manufacture Part Number 1: LQM18FN100M00D; Component Group: Inductor; Case-EIA: 0603; Case-Metric: 1608; Tolerance: ±20%; PP Material Stack: 0; Part Number: LCHIP-10U-0603; Footprint: 0603; Pin Count: 2; Supplier 1: Digi-Key; Supplier Part Number 1: 490-4025-1-ND; Value: 10u; Mounting Technology: SMT; Component Kind: Standard; Component Type: Standard; PP Rotation: 0
R9 = RCHIP-1R0-0603: 1R0 res, 0603, 1%, 1/10W; Manufacture 1: Yageo; Manufacture Part Number 1: RC0603FR-071RL; Component Group: Resistor; Case-EIA: 0603; Case-Metric: 1608; Rated Power: 0.1W; Rated Voltage: 75VDC; Part Number: RCHIP-1R0-0603; Footprint: 0603; Pin Count: 2; Supplier 1: Digi-Key; Supplier Part Number 1: 311-1.00HRCT-ND; Value: 1R0; Tolerance: 1%; Mounting Technology: SMT; Temperature Range: -55C to 155C; Component Kind: Standard; Component Type: Standard
R10-R13 = RCHIP-100K-0603: 100k res, 0603, 1%, 1/10W; Manufacture 1: Yageo; Manufacture Part Number 1: RC0603FR-07100KL; Component Group: Resistor; Case-EIA: 0603; Case-Metric: 1608; Rated Power: 0.1W; Rated Voltage: 75VDC; Part Number: RCHIP-100K-0603; Footprint: 0603; Pin Count: 2; Supplier 1: Digi-Key; Supplier Part Number 1: 311-100KHRCT-ND; Value: 100k; Tolerance: 1%; Mounting Technology: SMT; Temperature Range: -55C to 155C; Component Kind: Standard; Component Type: Standard
R14-R16 = RCHIP-1K-0603: 1k res, 0603, 1%, 1/10W; Manufacture 1: Yageo; Manufacture Part Number 1: RC0603FR-071KL; Component Group: Resistor; Case-EIA: 0603; Case-Metric: 1608; Rated Power: 0.1W; Rated Voltage: 75VDC; Part Number: RCHIP-1K-0603; Footprint: 0603; Pin Count: 2; Supplier 1: Digi-Key; Supplier Part Number 1: 311-1.00KHRCT-ND; Value: 1k; Tolerance: 1%; Mounting Technology: SMT; Temperature Range: -55C to 155C; Component Kind: Standard; Component Type: Standard
R17 R18 = RCHIP-39R-0603: 39R res, 0603, 1%, 1/10W; Manufacture 1: Yageo; Manufacture Part Number 1: RC0603FR-0739RL; Component Group: Resistor; Case-EIA: 0603; Case-Metric: 1608; Rated Power: 0.1W; Rated Voltage: 75VDC; Part Number: RCHIP-39R-0603; Footprint: 0603; Pin Count: 2; Supplier 1: Digi-Key; Supplier Part Number 1: 311-39.0HRCT-ND; Value: 39R; Tolerance: 1%; Mounting Technology: SMT; Temperature Range: -55C to 155C; Component Kind: Standard; Component Type: Standard
R19 = RCHIP-6K8-0603: 6k8 res, 0603, 1%, 1/10W; Manufacture 1: Yageo; Manufacture Part Number 1: RC0603FR-076K8L; Component Group: Resistor; Case-EIA: 0603; Case-Metric: 1608; Rated Power: 0.1W; Rated Voltage: 75VDC; Part Number: RCHIP-6K8-0603; Footprint: 0603; Pin Count: 2; Supplier 1: Digi-Key; Supplier Part Number 1: 311-6.80KHRCT-ND; Value: 6k8; Tolerance: 1%; Mounting Technology: SMT; Temperature Range: -55C to 155C; Component Kind: Standard; Component Type: Standard
SJ1 = SJ_2S_NO: Solder Jumper, NO; Component Group: PCB Feature; Part Number: SJ_2S_NO; Pin Count: 2; Mounting Technology: COPPER; Component Type: Standard (No BOM)
U7 = CMP-0076-00087-2: AT91 ARM Cortex-M3 32-bit Microcontroller, 128KB Flash, 36KB SRAM, 57 User I/Os, 3USARTs, 100-Pin LQFP, Industrial Grade (-40°C to 85°C), Pb-Free; ComponentLink3URL: http://www.atmel.com/dyn/resources/prod_documents/6430s.pdf; PackageReference: LQFP100; ComponentLink2Description: SAM3U Series Datasheet; Code_JEDEC: MS-026-BED; ComponentLink1Description: Manufacturer URL; PackageVersion: Apr-2006; PackageDescription: 100-Pin Thin Quad Flat Pack 0.5 mm Pitch; DatasheetVersion: revC, Apr-2010; RevisionNote: DatasheetVersion updated. URLs added.; ComponentLink3Description: SAM3U Series Summary; ComponentLink2URL: http://www.atmel.com/dyn/resources/prod_documents/doc6430.pdf; ComponentLink1URL: http://www.atmel.com/; PartId: 1
X2 = ABM8G-12.000MHZ-4Y-T3: CRYSTAL 12.0000MHZ 10PF SMD; Manufacture 1: Abracon LLC; Part Number: ABM8G-12.000MHZ-4Y-T3; Component Group: Crystal; Manufacture Part Number 1: ABM8G-12.000MHZ-4Y-T3; Pin Count: 4; Supplier 1: Digi-Key; Supplier Part Number 1: 535-10901-1-ND; Component Kind: Standard; Component Type: Standard; Value: 12.000MHz

## Sheet fpga_misc.SchDoc: FPGA Misc
size Letter; SheetNumber: 6; SheetTotal: 8; SheetApproved: YES
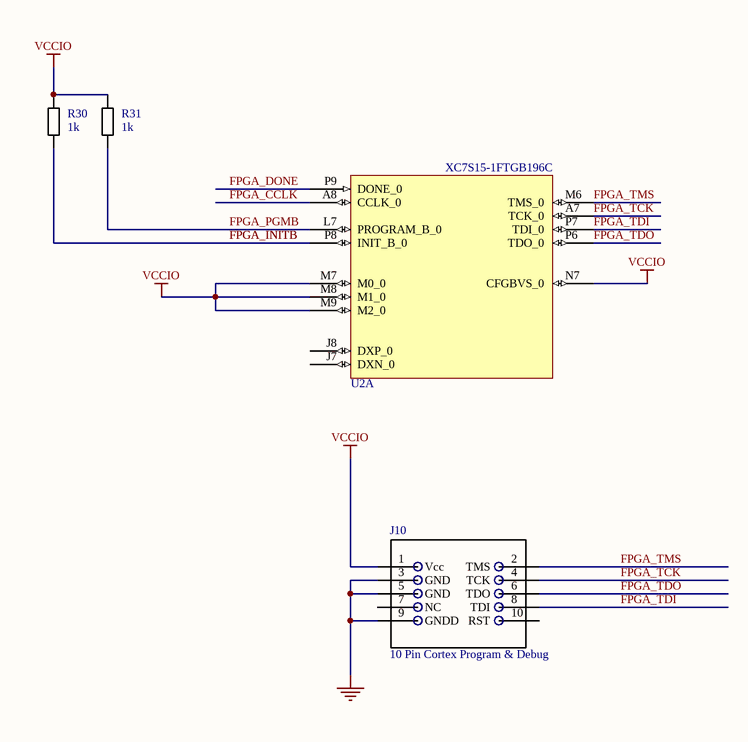
[diagram p5: fpga_misc.SchDoc]

### Parts
J10  10 Pin Cortex Program & Debug  [0.5mm_SMD_Header_5x2]
R30  1k  [RESC1608X55N]
R31  1k  [RESC1608X55N]
U2  XC7S15-1FTGB196C  [BGA_FTGB196]  (part A of 4)

### Nets
GND: J10.3(GND) J10.5(GND) J10.9(GNDD)
VCCIO: J10.1(Vcc) R30.1 R31.1 U2.M7(M0_0) U2.M8(M1_0) U2.M9(M2_0) U2.N7(CFGBVS_0)
FPGA_CCLK: U2.A8(CCLK_0)
FPGA_DONE: U2.P9(DONE_0)
FPGA_INITB: R30.2 U2.P8(INIT_B_0)
FPGA_PGMB: R31.2 U2.L7(PROGRAM_B_0)
FPGA_TCK: J10.4(TCK) U2.A7(TCK_0)
FPGA_TDI: J10.8(TDI) U2.P7(TDI_0)
FPGA_TDO: J10.6(TDO) U2.P6(TDO_0)
FPGA_TMS: J10.2(TMS) U2.M6(TMS_0)

Not connected (* = marked no-connect by the designer): J10 7(NC) 10(RST); U2 J7(DXN_0) J8(DXP_0)

### Notes on the sheet
- Title:
- Date:
- Rev:
- Time:
- Project:
- Sheet
- of
- License:
- Copyright © NewAE Technology Inc.
- Approved:
- NewAE.com
- File:

### Library data of the parts
J10 = Cortex_Debug_Header_10Pin: as J6 on sheet ct_micro; Part Number: Cortex_Debug_Header_10Pin; Pin Count: 10; Supplier 1: Digi-Key; Supplier Part Number 1: 609-3695-1-ND; Mounting Technology: SMT; RoHS: Yes; Component Kind: Standard; Component Type: Standard; PP Rotation: 0
R30 R31 = RCHIP-1K-0603: as R14 on sheet ct_micro; Part Number: RCHIP-1K-0603; Footprint: 0603; Pin Count: 2; Supplier 1: Digi-Key; Supplier Part Number 1: 311-1.00KHRCT-ND; Value: 1k; Tolerance: 1%; Mounting Technology: SMT; Temperature Range: -55C to 155C; Component Kind: Standard; Component Type: Standard
U2 = XC7S15-1FTGB196C: as U2 on sheet ct_fpga_io; Part Number: XC7S15-1FTGB196C; Manufacture 1: Xilinx; Manufacture Part Number 1: XC7S15-1FTGB196C; Pin Count: 196; Supplier 1: Digi-Key; Supplier Part Number 1: 122-2226-ND; Mounting Technology: SMT; Component Kind: Standard; Component Type: Standard; PP Rotation: 0

## Sheet ct_frontend.SchDoc: USB Interface
size Letter; Organization: NewAE Technology Inc.; Address1: 1083 Queen St., Suite 196; Address2: Halifax; Address3: NS; Address4: Canada B3H 0B2; SheetNumber: 7; SheetTotal: 8; SheetApproved: YES
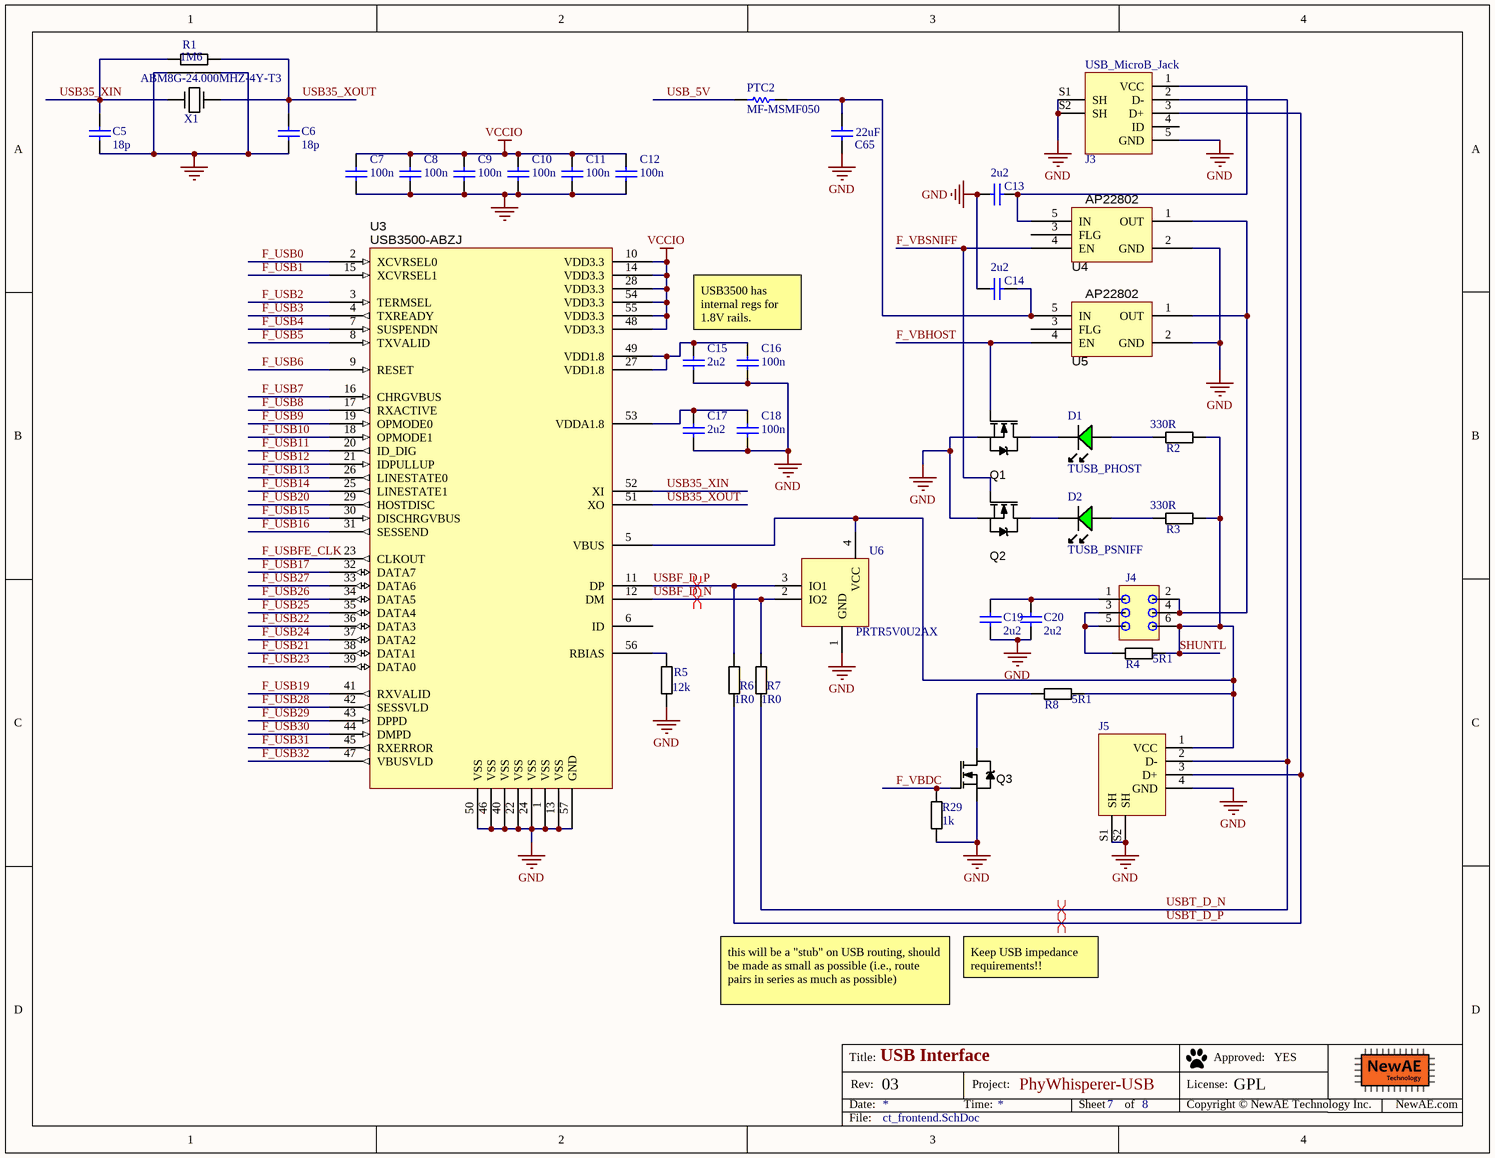
[diagram p6: ct_frontend.SchDoc]

### Parts
C5  18p  [CAPC0402_M]
C6  18p  [CAPC0402_M]
C7  100n  [CAPC0603_M]
C8  100n  [CAPC0603_M]
C9  100n  [CAPC0603_M]
C10  100n  [CAPC0603_M]
C11  100n  [CAPC0603_M]
C12  100n  [CAPC0603_M]
C13  2u2  [CAPC0603_M]
C14  2u2  [CAPC0603_M]
C15  2u2  [CAPC0603_M]
C16  100n  [CAPC0603_M]
C17  2u2  [CAPC0603_M]
C18  100n  [CAPC0603_M]
C19  2u2  [CAPC0603_M]
C20  2u2  [CAPC0603_M]
C65  22uF  [CAPC0805_M]
D1  TUSB_PHOST  [LED-0603-GREEN]
D2  TUSB_PSNIFF  [LED-0603-GREEN]
J3  USB_MicroB_Jack  [ZX62D-B-5P8(30)]
J4  TSW-103-08-F-D-RA  [HDR_6PIN_2ROW_RA_UNSHROUDED]  (value not drawn)
J5  USB-A-S-F-W-TH  [USB-A-S-F-W-TH]  (value not drawn)
PTC2  MF-MSMF050  [BOUR-MF-MSMF050-2_V]
Q1  DMN3200U-7  [SOT95P245X110-3M]  (value not drawn)
Q2  DMN3200U-7  [SOT95P245X110-3M]  (value not drawn)
Q3  DMN3200U-7  [SOT95P245X110-3M]  (value not drawn)
R1  1M6  [RESC1608X55N]
R2  330R  [RESC1608X55N]
R3  330R  [RESC1608X55N]
R4  5R1  [RESC2012X70N]
R5  12k  [RESC1608X55N]
R6  1R0  [RESC1608X55N]
R7  1R0  [RESC1608X55N]
R8  5R1  [RESC2012X70N]
R29  1k  [RESC1608X55N]
U3  USB3500-ABZJ  [QFN50P800X800X100_HS-57M]
U4  AP22802  [SOT23-5P95_285X145L45X40]
U5  AP22802  [SOT23-5P95_285X145L45X40]
U6  PRTR5V0U2AX  [SOT143B]
X1  ABM8G-24.000MHZ-4Y-T3  [ABM8G]

### Nets
GND: C5.2 C6.2 C7.2 C8.2 C9.2 C10.2 C11.2 C12.2 C13.1 C14.1 C15.2 C16.2 C17.2 C18.2 C19.1 C20.1 C65.2 J3.5(GND) J3.S1(SH) J3.S2(SH) J5.4(GND) J5.S1(SH) J5.S2(SH) Q1.2(S) Q2.2(S) Q3.2(S) R5.2 R29.1 U3.1(VSS) U3.13(VSS) U3.22(VSS) U3.24(VSS) U3.40(VSS) U3.46(VSS) U3.50(VSS) U3.57(GND) U4.2(GND) U5.2(GND) U6.1(GND) X1.2(GND) X1.4(GND)
VCCIO: C7.1 C8.1 C9.1 C10.1 C11.1 C12.1 U3.10(VDD3.3) U3.14(VDD3.3) U3.28(VDD3.3) U3.48(VDD3.3) U3.54(VDD3.3) U3.55(VDD3.3)
F_USB0: U3.2(XCVRSEL0)
F_USB1: U3.15(XCVRSEL1)
F_USB2: U3.3(TERMSEL)
F_USB3: U3.4(TXREADY)
F_USB4: U3.7(SUSPENDN)
F_USB5: U3.8(TXVALID)
F_USB6: U3.9(RESET)
F_USB7: U3.16(CHRGVBUS)
F_USB8: U3.17(RXACTIVE)
F_USB9: U3.19(OPMODE0)
F_USB10: U3.18(OPMODE1)
F_USB11: U3.20(ID_DIG)
F_USB12: U3.21(IDPULLUP)
F_USB13: U3.26(LINESTATE0)
F_USB14: U3.25(LINESTATE1)
F_USB15: U3.30(DISCHRGVBUS)
F_USB16: U3.31(SESSEND)
F_USB17: U3.32(DATA7)
F_USB19: U3.41(RXVALID)
F_USB20: U3.29(HOSTDISC)
F_USB21: U3.38(DATA1)
F_USB22: U3.36(DATA3)
F_USB23: U3.39(DATA0)
F_USB24: U3.37(DATA2)
F_USB25: U3.35(DATA4)
F_USB26: U3.34(DATA5)
F_USB27: U3.33(DATA6)
F_USB28: U3.42(SESSVLD)
F_USB29: U3.43(DPPD)
F_USB30: U3.44(DMPD)
F_USB31: U3.45(RXERROR)
F_USB32: U3.47(VBUSVLD)
F_USBFE_CLK: U3.23(CLKOUT)
F_VBDC: Q3.1(G) R29.2
F_VBHOST: Q1.1(G) U5.4(EN)
F_VBSNIFF: Q2.1(G) U4.4(EN)
SHUNTL: J4.6 J5.1(VCC) R2.2 R3.2 R4.2 R8.2 U3.5(VBUS) U6.4(VCC)
USB35_XIN: C5.1 R1.1 U3.52(XI) X1.1(IN)
USB35_XOUT: C6.1 R1.2 U3.51(XO) X1.3(OUT)
USB_5V: PTC2.1
USBF_D_N: R7.1 U3.12(DM) U6.2(IO2)
USBF_D_P: R6.1 U3.11(DP) U6.3(IO1)
USBT_D_N: J3.2(D-) J5.2(D-) R7.2
USBT_D_P: J3.3(D+) J5.3(D+) R6.2
NetC13_2: C13.2 J3.1(VCC) U4.5(IN)
NetC14_2: C14.2 C65.1 PTC2.2 U5.5(IN)
NetC15_1: C15.1 C16.1 U3.27(VDD1.8) U3.49(VDD1.8)
NetC17_1: C17.1 C18.1 U3.53(VDDA1.8)
NetC19_2: C19.2 C20.2 J4.1
NetD1_A: D1.A R2.1
NetD1_K: D1.K Q1.3(D)
NetD2_A: D2.A R3.1
NetD2_K: D2.K Q2.3(D)
NetJ4_2: J4.2 J4.4 U4.1(OUT) U5.1(OUT)
NetJ4_3: J4.3 J4.5 R4.1
NetQ3_3: Q3.3(D) R8.1
NetR5_1: R5.1 U3.56(RBIAS)

Not connected (* = marked no-connect by the designer): J3 4(ID); U3 6(ID); U4 3(FLG); U5 3(FLG)

### Layout directives
differential pair: USBF_D_N, USBF_D_P, USBT_D_N, USBT_D_P

### Notes on the sheet
- USB3500 has internal regs for 1.8V rails.
- Keep USB impedance requirements!!
- this will be a "stub" on USB routing, should be made as small as possible (i.e., route pairs in series as much as possible)
- Title:
- Date:
- Rev:
- Time:
- Project:
- Sheet
- of
- License:
- Copyright © NewAE Technology Inc.
- Approved:
- NewAE.com
- File:

### Library data of the parts
C5 C6 = CCHIP-18p-0402: as C36 on sheet ct_micro; Part Number: CCHIP-18p-0402; Footprint: 0402; Pin Count: 2; Value: 18p; Mounting Technology: SMT; Component Kind: Standard; Component Type: Standard
C7-C12 C16 C18 = CCHIP-100n-0603: as C39 on sheet ct_psu; Part Number: CCHIP-100n-0603; Footprint: 0603; Pin Count: 2; Supplier 1: Digi-Key; Supplier Part Number 1: 399-5089-2-ND; Value: 100n; Mounting Technology: SMT; Component Kind: Standard; Component Type: Standard
C13-C15 C17 C19 C20 = CCHIP-2u2-0603: as C1 on sheet ct_back; Part Number: CCHIP-2u2-0603; Footprint: 0603; Pin Count: 2; Supplier 1: Digi-Key; Supplier Part Number 1: 1276-1134-2-ND; Value: 2u2; Mounting Technology: SMT; Component Kind: Standard; Component Type: Standard
C65 = CCHIP-22u-0805-16V: as C59 on sheet ct_psu; Part Number: CCHIP-22u-0805-16V; Footprint: 0805; Pin Count: 2; Supplier 1: Digi-Key; Supplier Part Number 1: 1276-6780-1-ND; Value: 22uF; Mounting Technology: SMT; RoHS: Yes; Component Kind: Standard; Component Type: Standard
D1 D2 = LEDCHIP_0603_GREEN: Chip LED, Green; Manufacture 1: Kingbright; Manufacture Part Number 1: APT1608CGCK; Component Group: Optical; PP Material Stack: 16; PP Rotation: -90; Part Number: LEDCHIP_0603_GREEN; Pin Count: 2; Supplier 1: Digi-Key; Supplier Part Number 1: 754-1116-1-ND; Mounting Technology: SMT; Component Kind: Standard; Component Type: Standard
J3 = ZX62D-B-5P8(30): as J1 on sheet ct_back; Part Number: ZX62D-B-5P8(30); Manufacture Part Number 1: ZX62D-B-5P8(30); Pin Count: 5; Supplier 1: Digi-Key; Supplier Part Number 1: H125272CT-ND; Mounting Technology: Through-hole; RoHS: Yes; Component Kind: Standard; Component Type: Standard; PP Rotation: 0
J4 = HDR_6PIN_2ROW_RA_UNSHROUDED: 2x3 Header, R/A, Unshrouded; Manufacture 1: Samtec; Component Group: Connector; PP Material Stack: 0; Part Number: HDR_6PIN_2ROW_RA_UNSHROUDED; Footprint: HDR_6PIN_2ROW_UNSHROUDED; Manufacture Part Number 1: TSW-103-08-F-D-RA; Pin Count: 6; Component Kind: Standard; Component Type: Standard; PP Rotation: 0
J5 = USB-A-S-F-W-TH: Female USB-A; Manufacture 1: Samtec; Component Group: Connector; PP Material Stack: 0; Part Number: USB-A-S-F-W-TH; Manufacture Part Number 1: USB-A-S-F-W-TH; Pin Count: 6; Component Kind: Standard; Component Type: Standard; PP Rotation: 0
PTC2 = CMP-0280-00002-2: as PTC1 on sheet ct_back; ComponentLink1Description: Manufacturer URL; Operating Temperature Range: -40 to 85 degC; ComponentLink2URL: http://www.bourns.com/data/global/pdfs/mfmsmf.pdf; PackageReference: MF-MSMF050; ComponentLink2Description: Datasheet; PartNumber: MF-MSMF050; DatasheetVersion: Rev. AD; ComponentLink3URL: http://www.bourns.com/data/global/pdfs/mfmsmf.pdf; ComponentLink3Description: Package Specification; RoHS: TRUE; PackageDescription: 2-Pin SMD, Body 4.55 x 3.24 mm; Mounting Technology: Surface Mount; Packing: Reel; Resistance (Min): 0.15 Ohm; ComponentLink1URL: http://www.bourns.com/; Supplier 1: Digi-Key; Supplier Part Number 1: MF-MSMF050-2CT-ND
Q1-Q3 = DMN3200U-7: MOSFET N-CH 30V 2.2A SOT23-3; Manufacture 1: Diodes Inc.; Rated Power: 3A; PP Material Stack: 0; Part Number: DMN3200U-7; Component Group: MOSFET; Footprint: SOT23; Manufacture Part Number 1: DMN3200U-7; Pin Count: 3; Supplier 1: Digi-Key; Supplier Part Number 1: DMN3200U-7DICT-ND; Rated Voltage: 30V; Mounting Technology: SMT; RoHS: Yes; Component Kind: Standard; Component Type: Standard; PP Rotation: 0
R1 = RCHIP-1M6-0603: 1M6 res, 0603, 1%, 1/10W; Manufacture 1: Yageo; Manufacture Part Number 1: RC0603FR-071M6L; Component Group: Resistor; Case-EIA: 0603; Case-Metric: 1608; Rated Power: 0.1W; Rated Voltage: 75VDC; Part Number: RCHIP-1M6-0603; Footprint: 0603; Pin Count: 2; Supplier 1: Digi-Key; Supplier Part Number 1: YAG3327CT-ND; Value: 1M6; Tolerance: 1%; Mounting Technology: SMT; RoHS: Yes; Temperature Range: -55C to 155C; Component Kind: Standard; Component Type: Standard
R2 R3 = RCHIP-330R-0603: 330R res, 0603, 1%, 1/10W; Manufacture 1: Yageo; Manufacture Part Number 1: RC0603FR-07330RL; Component Group: Resistor; Case-EIA: 0603; Case-Metric: 1608; Rated Power: 0.1W; Rated Voltage: 75VDC; Part Number: RCHIP-330R-0603; Footprint: 0603; Pin Count: 2; Supplier 1: Digi-Key; Supplier Part Number 1: 311-330HRCT-ND; Value: 330R; Tolerance: 1%; Mounting Technology: SMT; Temperature Range: -55C to 155C; Component Kind: Standard; Component Type: Standard
R4 R8 = RCHIP-5R1-0805: 5R1  res, 0805, 1%; Component Group: Resistor; Case-EIA: 0805; Part Number: RCHIP-5R1-0805; Footprint: 0805; Pin Count: 2; Value: 5R1; Component Kind: Standard; Component Type: Standard; Supplier 1: Digi-Key; Supplier Part Number 1: YAG3373CT-ND
R5 = RCHIP-12K-0603: 12k res, 0603, 1%, 1/10W; Manufacture 1: Yageo; Manufacture Part Number 1: RC0603FR-0712KL; Component Group: Resistor; Case-EIA: 0603; Case-Metric: 1608; Rated Power: 0.1W; Rated Voltage: 75VDC; Part Number: RCHIP-12K-0603; Footprint: 0603; Pin Count: 2; Supplier 1: Digi-Key; Supplier Part Number 1: 311-12.0KHRCT-ND; Value: 12k; Tolerance: 1%; Mounting Technology: SMT; Temperature Range: -55C to 155C; Component Kind: Standard; Component Type: Standard
R6 R7 = RCHIP-1R0-0603: as R9 on sheet ct_micro; Part Number: RCHIP-1R0-0603; Footprint: 0603; Pin Count: 2; Supplier 1: Digi-Key; Supplier Part Number 1: 311-1.00HRCT-ND; Value: 1R0; Tolerance: 1%; Mounting Technology: SMT; Temperature Range: -55C to 155C; Component Kind: Standard; Component Type: Standard
R29 = RCHIP-1K-0603: as R14 on sheet ct_micro; Part Number: RCHIP-1K-0603; Footprint: 0603; Pin Count: 2; Supplier 1: Digi-Key; Supplier Part Number 1: 311-1.00KHRCT-ND; Value: 1k; Tolerance: 1%; Mounting Technology: SMT; Temperature Range: -55C to 155C; Component Kind: Standard; Component Type: Standard
U3 = USB3500: USB Phy, UTMI 3+; Manufacture 1: Texas Instruments; Company_PN: <Enter Company P/N>; Component Group: Digital IC; Pitch: 0.5mm; PP Material Stack: 0; Created By: D.GODDARD; Part Number: USB3500; Footprint: QFN56; Manufacture Part Number 1: USB3500-ABZJ; Pin Count: 57; Supplier 1: Digi-Key; Supplier Part Number 1: 638-1035-ND; Mounting Technology: SMT; RoHS: Yes; Component Kind: Standard; Component Type: Standard; PP Rotation: 0
U4 U5 = AP22802: USB Power Switch, Digital IC; Manufacture 1: Diodes Inc; Company_PN: <Enter Company P/N>; Component Group: Analog IC; PP Material Stack: 0; Created By: D.GODDARD; Part Number: AP22802; Footprint: SOT25; Manufacture Part Number 1: AP22802; Pin Count: 5; Supplier 1: Digi-Key; Supplier Part Number 1: AP22802AW5-7DICT-ND; Component Kind: Standard; Component Type: Standard; PP Rotation: 0
U6 = PRTR5V0U2AX: as U1 on sheet ct_back; Part Number: PRTR5V0U2AX; Pin Count: 4; Supplier 1: Digi-Key; Supplier Part Number 1: 568-7445-1-ND; Component Kind: Standard; Component Type: Standard
X1 = ABM8G-24.000MHZ-4Y-T3: CRYSTAL 24.0000MHZ 10PF SMD; Manufacture 1: Abracon LLC; Part Number: ABM8G-24.000MHZ-4Y-T3; Component Group: Crystal; Manufacture Part Number 1: ABM8G-24.000MHZ-4Y-T3; Pin Count: 4; Supplier 1: Digi-Key; Supplier Part Number 1: 535-10913-1-ND; Component Kind: Standard; Component Type: Standard; Value: 24.000MHz

## Sheet ct_userio.SchDoc: User I/O
size Letter; Organization: NewAE Technology Inc.; Address1: 1083 Queen St., Suite 196; Address2: Halifax; Address3: NS; Address4: Canada B3H 0B2; SheetNumber: 8; SheetTotal: 8; SheetApproved: YES
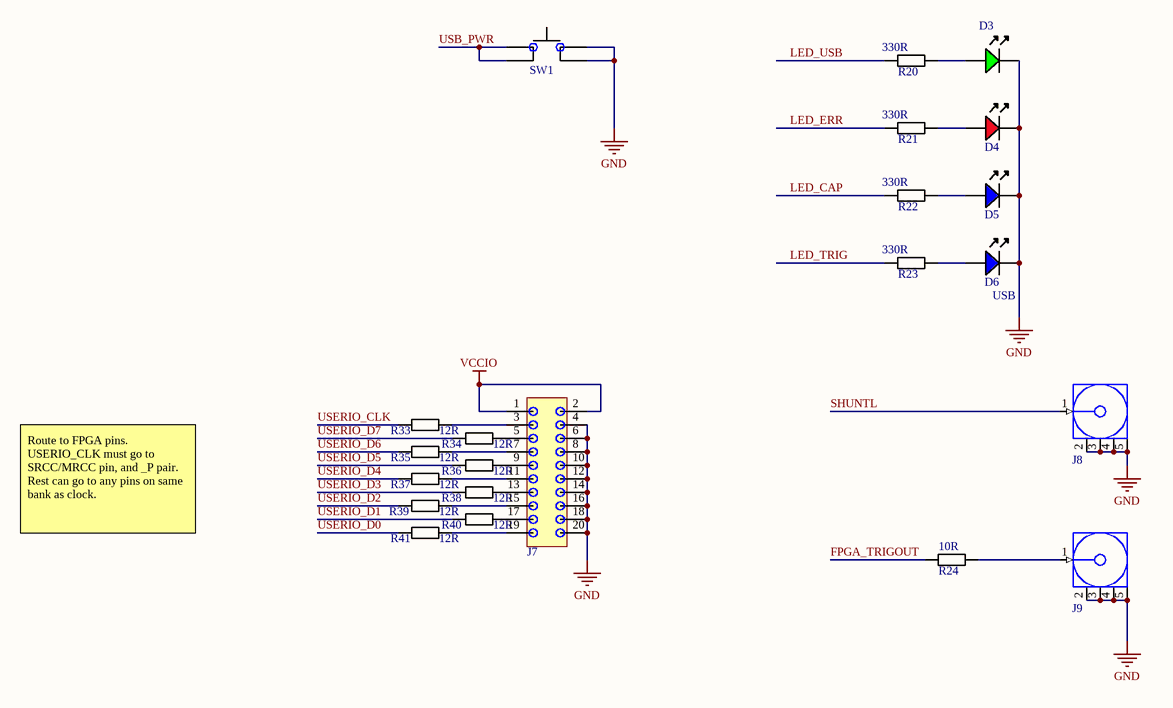
[diagram p7: ct_userio.SchDoc]

### Parts
D3  (no value)  [LED-0603-GREEN]
D4  LED, 0603, Red  [LED-0603-RED]  (value not drawn)
D5  LED, 0603, Blue  [LED-0603-BLUE]  (value not drawn)
D6  USB  [LED-0603-BLUE]
J7  EW-10-09-G-D-300  [EW-10-09-G-D-300]  (value not drawn)
J8  MCX 733660061  [CONN_MCX_733660061]  (value not drawn)
J9  MCX 733660061  [CONN_MCX_733660061]  (value not drawn)
R20  330R  [RESC1608X55N]
R21  330R  [RESC1608X55N]
R22  330R  [RESC1608X55N]
R23  330R  [RESC1608X55N]
R24  10R  [RESC1608X55N]
R33  12R  [RESC1005X40N]
R34  12R  [RESC1005X40N]
R35  12R  [RESC1005X40N]
R36  12R  [RESC1005X40N]
R37  12R  [RESC1005X40N]
R38  12R  [RESC1005X40N]
R39  12R  [RESC1005X40N]
R40  12R  [RESC1005X40N]
R41  12R  [RESC1005X40N]
SW1  KSC741J LFS  [CK_KSC7J]  (value not drawn)

### Nets
GND: D3.K D4.K D5.K D6.K J7.4 J7.6 J7.8 J7.10 J7.12 J7.14 J7.16 J7.18 J7.20 J8.2(GND) J8.3(GND) J8.4(GND) J8.5(GND) J9.2(GND) J9.3(GND) J9.4(GND) J9.5(GND) SW1.2(IN) SW1.3(IN)
VCCIO: J7.1 J7.2
FPGA_TRIGOUT: R24.1
LED_CAP: R22.1
LED_ERR: R21.1
LED_TRIG: R23.1
LED_USB: R20.1
SHUNTL: J8.1(Signal)
USB_PWR: SW1.1(IN) SW1.4(IN)
USERIO_CLK: R33.1
USERIO_D0: R41.1
USERIO_D1: R40.1
USERIO_D2: R39.1
USERIO_D3: R38.1
USERIO_D4: R37.1
USERIO_D5: R36.1
USERIO_D6: R35.1
USERIO_D7: R34.1
NetD3_A: D3.A R20.2
NetD4_A: D4.A R21.2
NetD5_A: D5.A R22.2
NetD6_A: D6.A R23.2
NetJ7_3: J7.3 R33.2
NetJ7_5: J7.5 R34.2
NetJ7_7: J7.7 R35.2
NetJ7_9: J7.9 R36.2
NetJ7_11: J7.11 R37.2
NetJ7_13: J7.13 R38.2
NetJ7_15: J7.15 R39.2
NetJ7_17: J7.17 R40.2
NetJ7_19: J7.19 R41.2
NetJ9_1: J9.1(Signal) R24.2

### Notes on the sheet
- Route to FPGA pins. USERIO_CLK must go to SRCC/MRCC pin, and _P pair. Rest can go to any pins on same bank as clock.
- Title:
- Date:
- Rev:
- Time:
- Project:
- Sheet
- of
- License:
- Copyright © NewAE Technology Inc.
- Approved:
- NewAE.com
- File:

### Library data of the parts
D3 = LEDCHIP_0603_GREEN: as D1 on sheet ct_frontend; Part Number: LEDCHIP_0603_GREEN; Pin Count: 2; Supplier 1: Digi-Key; Supplier Part Number 1: 754-1116-1-ND; Mounting Technology: SMT; Component Kind: Standard; Component Type: Standard
D4 = LEDCHIP_0603_RED: Chip LED, Red; Manufacture 1: Kingbright; Manufacture Part Number 1: APT1608SRCPRV; Component Group: Optical; PP Material Stack: 15; PP Rotation: -90; Part Number: LEDCHIP_0603_RED; Pin Count: 2; Supplier 1: Digi-Key; Supplier Part Number 1: 754-1122-1-ND; Mounting Technology: SMT; Component Kind: Standard; Component Type: Standard
D5 D6 = LEDCHIP_0603_BLUE: Chip LED, Blue; Manufacture 1: Kingbright; Component Group: Optical; Part Number: LEDCHIP_0603_BLUE; Pin Count: 2; Mounting Technology: SMT; Component Kind: Standard; Component Type: Standard
J7 = EW-10-09-G-D-300: 20-Pin Header, High-Top; Part Number: SBH11-PBPC-D10-ST-BK; Component Group: Connector; PP Material Stack: 0; Manufacture Part Number 1: SBH11-PBPC-D10-ST-BK; Pin Count: 20; Supplier 1: Digi-key; Component Kind: Standard; Component Type: Standard; PP Rotation: 0; Supplier Part Number 1: S9172-ND
J8 J9 = 733660061: MCX Straight; Manufacture Part Number 1: 29K101-400L5; Component Group: Connector; PP Material Stack: 0; Part Number: 733660061; Pin Count: 5; Supplier 1: Digi-Key; Mounting Technology: Through-hole; RoHS: Yes; Component Kind: Standard; Component Type: Standard; PP Rotation: 0; Supplier Part Number 1: 1868-1160-ND
R20-R23 = RCHIP-330R-0603: as R2 on sheet ct_frontend; Part Number: RCHIP-330R-0603; Footprint: 0603; Pin Count: 2; Supplier 1: Digi-Key; Supplier Part Number 1: 311-330HRCT-ND; Value: 330R; Tolerance: 1%; Mounting Technology: SMT; Temperature Range: -55C to 155C; Component Kind: Standard; Component Type: Standard
R24 = RCHIP-10R-0603: 10R res, 0603, 1%, 1/10W; Manufacture 1: Yageo; Manufacture Part Number 1: RC0603FR-0710RL; Component Group: Resistor; Case-EIA: 0603; Case-Metric: 1608; Rated Power: 0.1W; Rated Voltage: 75VDC; Part Number: RCHIP-10R-0603; Footprint: 0603; Pin Count: 2; Supplier 1: Digi-Key; Supplier Part Number 1: 311-10.0HRCT-ND; Value: 10R; Tolerance: 1%; Mounting Technology: SMT; Temperature Range: -55C to 155C; Component Kind: Standard; Component Type: Standard
R33-R41 = RCHIP-12R-0402: as R42 on sheet ct_back; Part Number: RCHIP-12R-0402; Footprint: 0402; Pin Count: 2; Supplier 1: Digi-Key; Supplier Part Number 1: YAG2968CT-ND; Value: 12R; Tolerance: 1%; Mounting Technology: SMT; Temperature Range: -55C to 155C; Component Kind: Standard; Component Type: Standard
SW1 = TACTSW-KSC741J: SWITCH TACTILE SPST-NO 0.01A 32V; Manufacture 1: C&K; PP Material Stack: 0; Part Number: TACTSW-KSC741J; Component Group: Switch; Manufacture Part Number 1: KSC741J LFS; Pin Count: 4; Supplier 1: Digi-Key; Supplier Part Number 1: CKN10309CT-ND; Mounting Technology: SMT; RoHS: Yes; Component Kind: Standard; Component Type: Standard; PP Rotation: 0